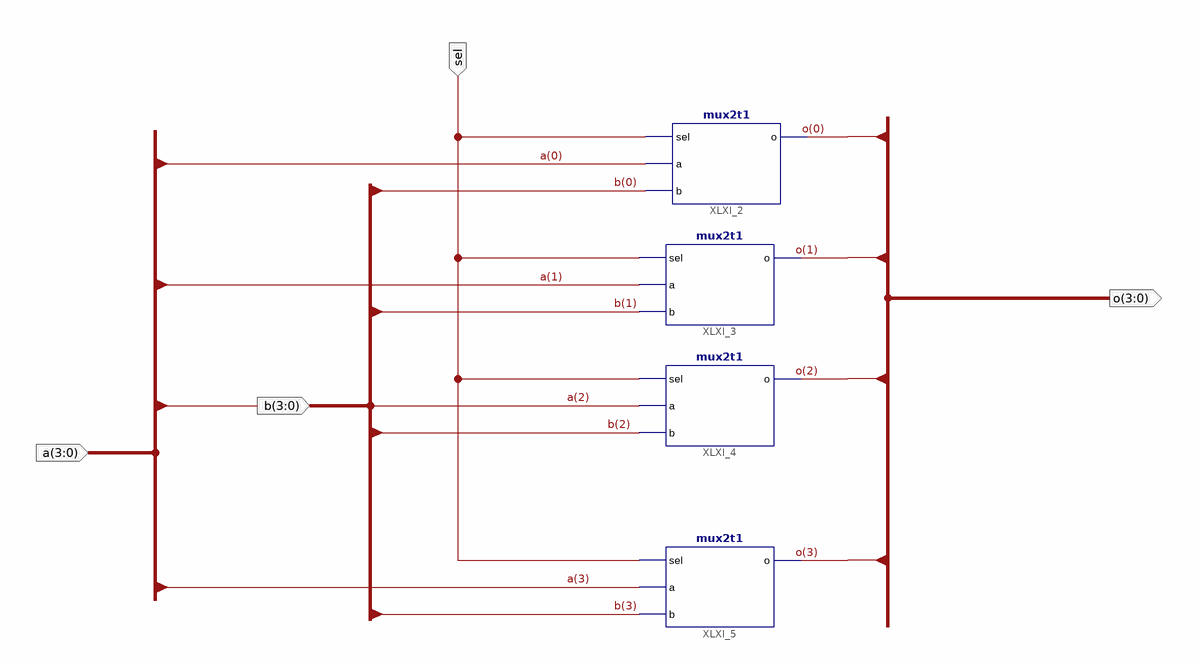
[diagram p0: schematic sheet 1]
// Xilinx ISE schematic mux2t1_4.sch (kintex7) as structural Verilog: 4 symbols, 4 ports
module mux2t1_4 (
  input  [3:0] b,
  input  [3:0] a,
  input  sel,
  output [3:0] o
);

  mux2t1 XLXI_2 (.sel(sel), .a(a[0]), .b(b[0]), .o(o[0]));
  mux2t1 XLXI_3 (.sel(sel), .a(a[1]), .b(b[1]), .o(o[1]));
  mux2t1 XLXI_4 (.sel(sel), .a(a[2]), .b(b[2]), .o(o[2]));
  mux2t1 XLXI_5 (.sel(sel), .a(a[3]), .b(b[3]), .o(o[3]));
endmodule
